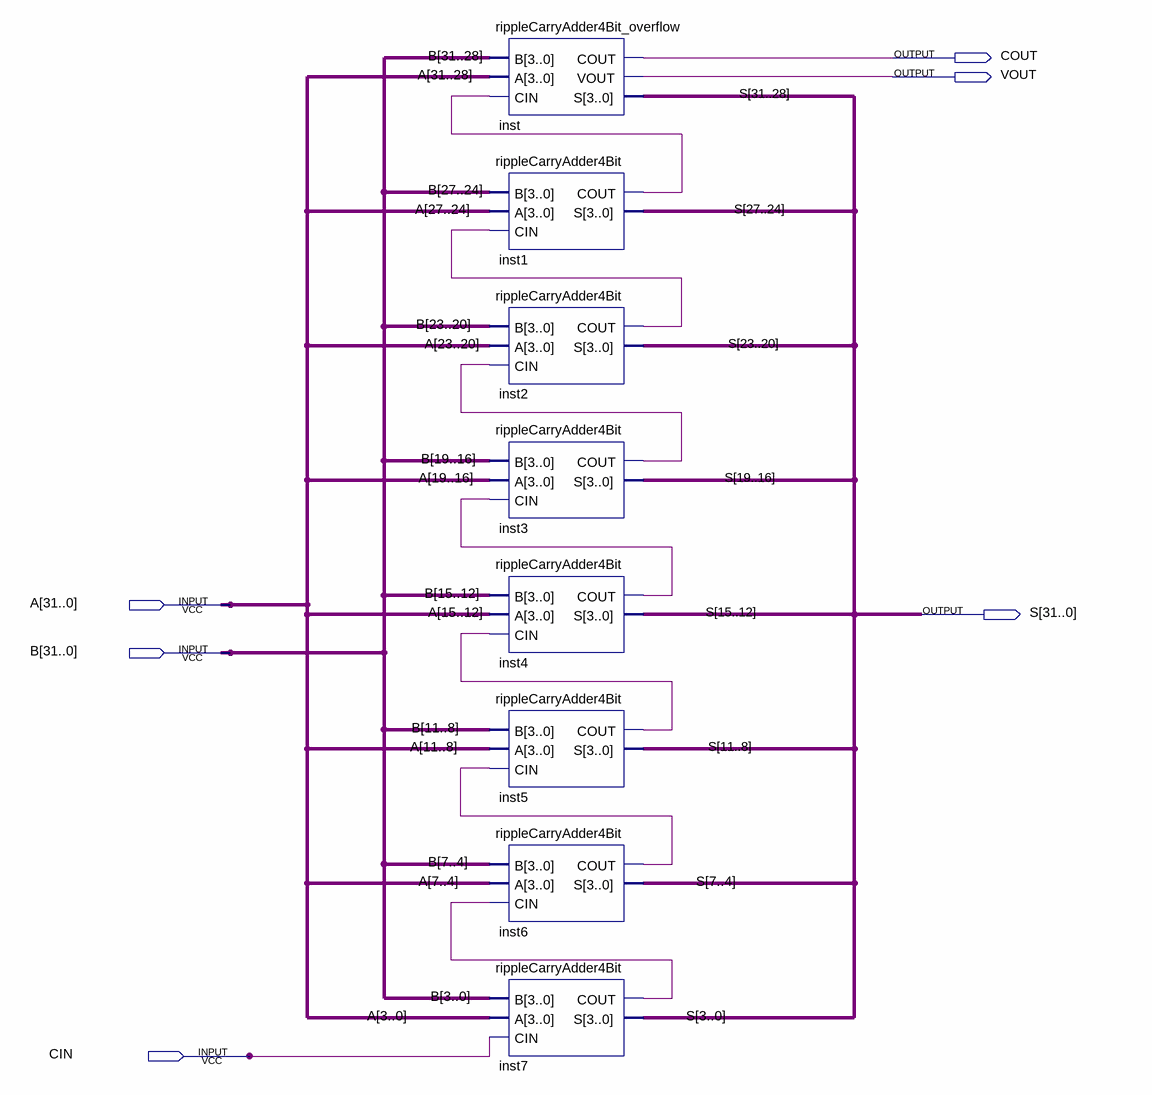
[diagram p0: schematic sheet]
// Quartus schematic rippleCarryAdder32Bit.bdf as structural Verilog: 8 symbols, 6 pins
module rippleCarryAdder32Bit (
  input  [31:0] A,
  input  [31:0] B,
  input  CIN,
  output COUT,
  output VOUT,
  output [31:0] S
);

  wire inst1_cout, inst2_cout, inst3_cout, inst4_cout, inst5_cout, inst6_cout, inst7_cout;

  rippleCarryAdder4Bit_overflow inst (
    .B(B[31:28]), .A(A[31:28]), .CIN(inst1_cout), .COUT(COUT), .VOUT(VOUT), .S(S[31:28]));
  rippleCarryAdder4Bit inst1 (.B(B[27:24]), .A(A[27:24]), .CIN(inst2_cout), .COUT(inst1_cout), .S(S[27:24]));
  rippleCarryAdder4Bit inst2 (.B(B[23:20]), .A(A[23:20]), .CIN(inst3_cout), .COUT(inst2_cout), .S(S[23:20]));
  rippleCarryAdder4Bit inst3 (.B(B[19:16]), .A(A[19:16]), .CIN(inst4_cout), .COUT(inst3_cout), .S(S[19:16]));
  rippleCarryAdder4Bit inst4 (.B(B[15:12]), .A(A[15:12]), .CIN(inst5_cout), .COUT(inst4_cout), .S(S[15:12]));
  rippleCarryAdder4Bit inst5 (.B(B[11:8]), .A(A[11:8]), .CIN(inst6_cout), .COUT(inst5_cout), .S(S[11:8]));
  rippleCarryAdder4Bit inst6 (.B(B[7:4]), .A(A[7:4]), .CIN(inst7_cout), .COUT(inst6_cout), .S(S[7:4]));
  rippleCarryAdder4Bit inst7 (.B(B[3:0]), .A(A[3:0]), .CIN(CIN), .COUT(inst7_cout), .S(S[3:0]));
endmodule
